# Altium schematic sheet EPS_DCDC_RLCL-FPF.SchDoc: DCDC / RLCL-FPF
size A4; SheetNumber: 35; SheetTotal: 51
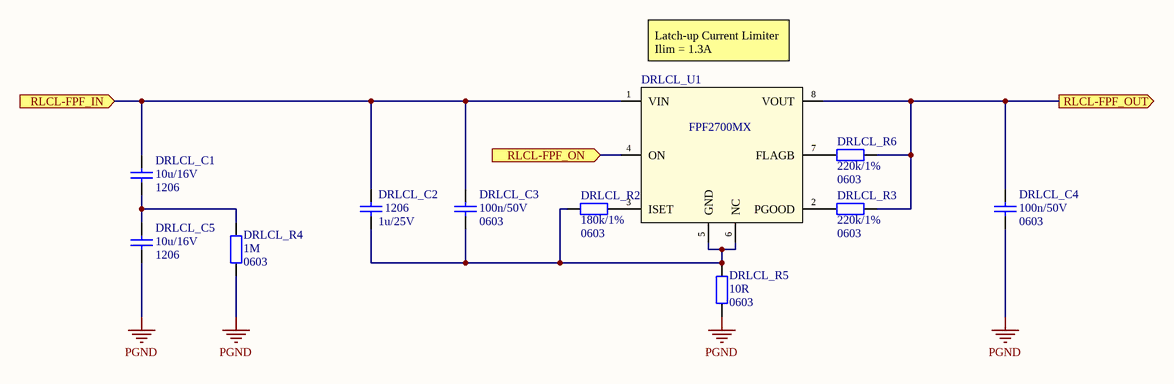
[diagram p0: EPS_DCDC_RLCL-FPF.SchDoc]

## Parts
DRLCL_C1  Packge: 1206  [SMD_Capacitor_1206]  (hidden comment: 10u/16V)
DRLCL_C2  Package: 1206  [SMD_Capacitor_1206]  (hidden comment: 1u/25V)
DRLCL_C3  Package: 0603  [SMD_Capacitor_0603]  (hidden comment: 100n/50V)
DRLCL_C4  Package: 0603  [SMD_Capacitor_0603]  (hidden comment: 100n/50V)
DRLCL_C5  Packge: 1206  [SMD_Capacitor_1206]  (hidden comment: 10u/16V)
DRLCL_R2  Package: 0603  [SMD_Resistor_0603]  (hidden comment: 180k/1%)
DRLCL_R3  Package: 0603  [SMD_Resistor_0603]  (hidden comment: 220k/1%)
DRLCL_R4  Package: 0603  [SMD_Resistor_0603]  (hidden comment: 1M)
DRLCL_R5  Package: 0603  [SMD_Resistor_0603]  (hidden comment: 10R)
DRLCL_R6  Package: 0603  [SMD_Resistor_0603]  (hidden comment: 220k/1%)
DRLCL_U1  FPF2700MX  [SOIC-8-N]

## Ports
RLCL-FPF_IN (in), RLCL-FPF_ON (in), RLCL-FPF_OUT (out)

## Nets
PGND: DRLCL_C4.2 DRLCL_C5.2 DRLCL_R4.1 DRLCL_R5.2
RLCL-FPF_IN: DRLCL_C1.1 DRLCL_C2.1 DRLCL_C3.1 DRLCL_U1.1(VIN) ; port RLCL-FPF_IN
RLCL-FPF_ON: DRLCL_U1.4(ON) ; port RLCL-FPF_ON
RLCL-FPF_OUT: DRLCL_C4.1 DRLCL_R3.2 DRLCL_R6.2 DRLCL_U1.8(VOUT) ; port RLCL-FPF_OUT
NetDRLCL_C1_2: DRLCL_C1.2 DRLCL_C5.1 DRLCL_R4.2
NetDRLCL_C2_2: DRLCL_C2.2 DRLCL_C3.2 DRLCL_R2.1 DRLCL_R5.1 DRLCL_U1.5(GND) DRLCL_U1.6(NC)
NetDRLCL_R2_2: DRLCL_R2.2 DRLCL_U1.3(ISET)
NetDRLCL_R3_1: DRLCL_R3.1 DRLCL_U1.2(PGOOD)
NetDRLCL_R6_1: DRLCL_R6.1 DRLCL_U1.7(FLAGB)

## Notes on the sheet
- (near DRLCL_U1) Latch-up Current Limiter
  Ilim = 1.3A
- Title:
- Project:
- Author:
- Model:
- Document Number:
- Checked by:
- Rev:
- Date:
- Approved by:
- Sheet:
- of
- File name:

## Library data of the parts
DRLCL_C1 DRLCL_C5 = Cer_C1206T106K4RACTU: Ceramic Cap Kemet COTS 10u/16V X7R 1206; ManufacturerPartNumber: C1206T106K4RACTU; Manufacturer: Kemet; Value: 10u/16V
DRLCL_C2 = Cer_C1206T105K3RALTU: Ceramic Cap Kemet COTS 1u/25V X7R 1206; ManufacturerPartNumber: C1206T105K3RALTU; Manufacturer: Kemet; Value: 1u/25V
DRLCL_C3 DRLCL_C4 = Cer_GCJ188R71H104KA12D: Ceramic Cap Murata Automotive 100n/50V X7R 0603; Manufacturer: Murata; ManufacturerPartNumber: GCJ188R71H104KA12D; Value: 100n/50V
DRLCL_R2-DRLCL_R6 = Res
  DRLCL_R2: Value: 180k/1%
  DRLCL_R3 DRLCL_R6: Value: 220k/1%
  DRLCL_R4: Value: 1M
  DRLCL_R5: Value: 10R
DRLCL_U1 = FPF2700MX: Adj over-current protection 0.4-2A, Load Switch; Manufacturer: Fairchild Semiconductor; Value: FPF2700MX